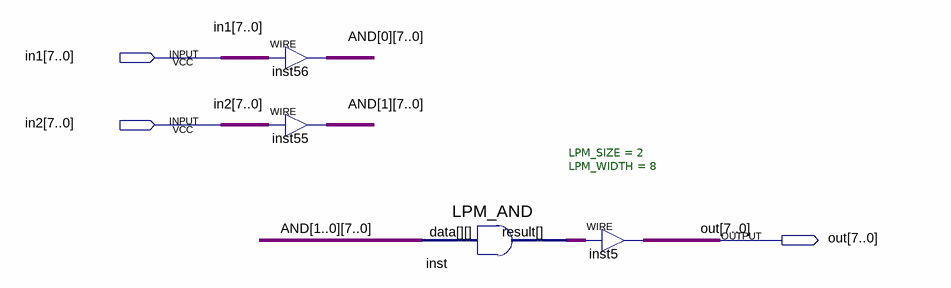
[diagram p0: schematic sheet]
// Quartus schematic andb8.bdf as structural Verilog: 4 symbols, 3 pins
module andb8 (
  input  [7:0] in1,
  input  [7:0] in2,
  output [7:0] out
);

  wire [7:0] AND_0, AND_1, inst_result;

  assign AND_0 = in1;  // WIRE inst56
  assign AND_1 = in2;  // WIRE inst55
  LPM_AND #(.LPM_SIZE(2), .LPM_WIDTH(8)) inst (.data({AND_1, AND_0}), .result(inst_result));
  assign out = inst_result;  // WIRE inst5
endmodule
